# Altium schematic sheet ADC_Configuration.SchDoc: ADC Configuration
size Tabloid; Date: 06/01/2023; Engineer: Terry D. Schevker; Revision: 1.0; SheetNumber: 4; SheetTotal: 7
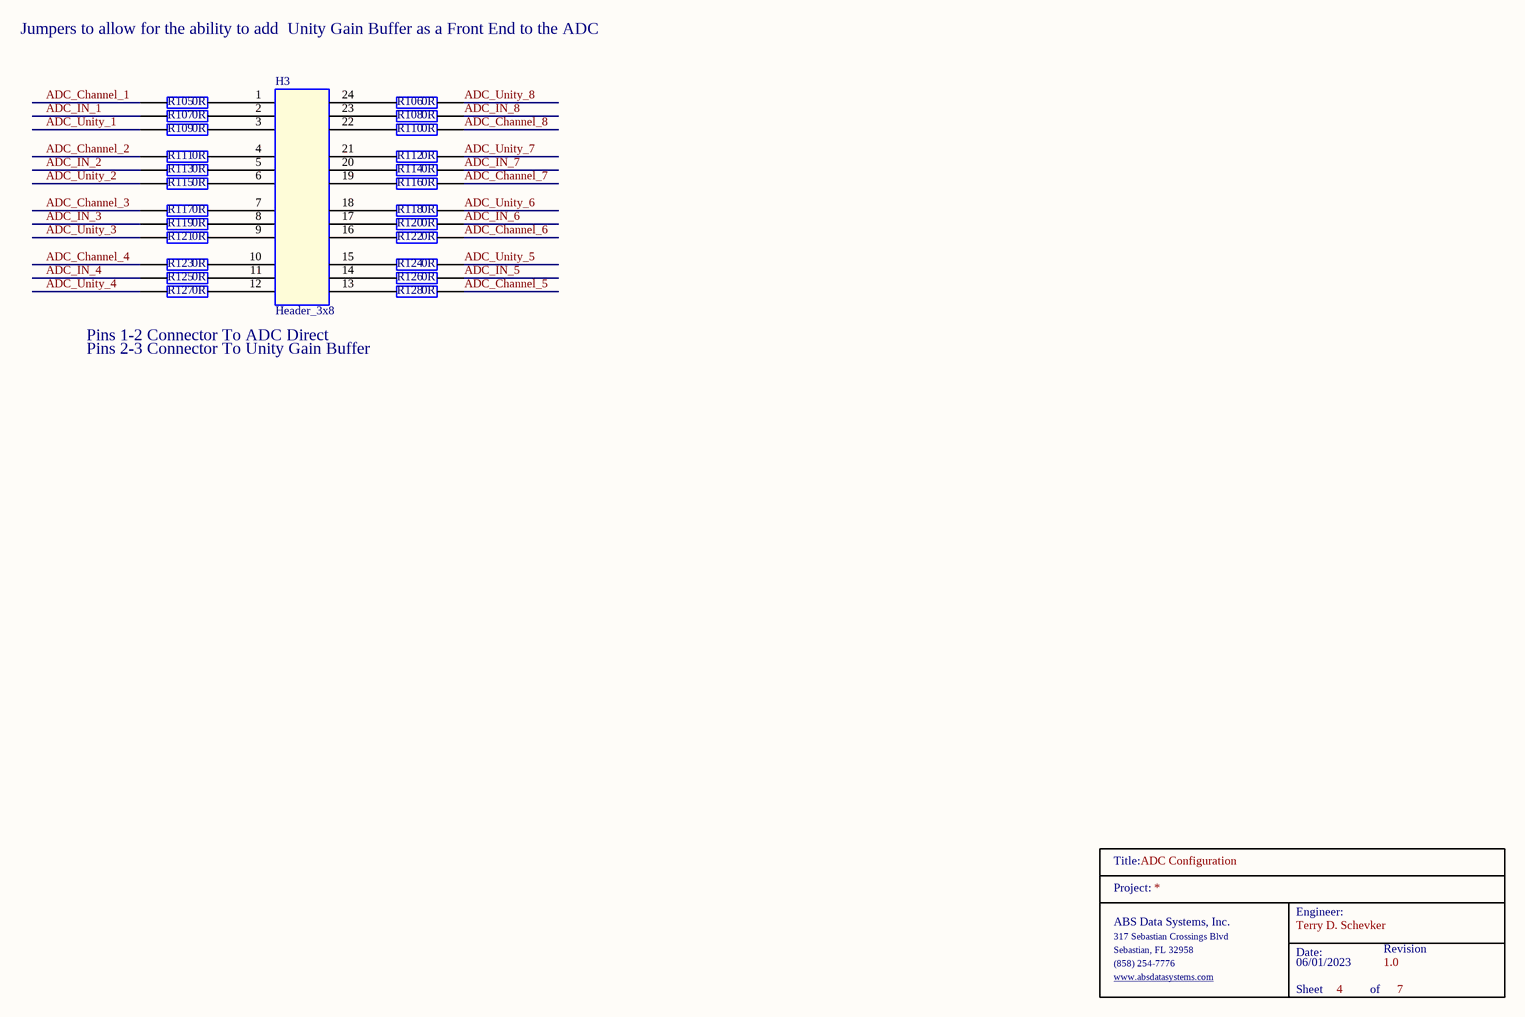
[diagram p0: ADC_Configuration.SchDoc]

## Parts
H3  Header_3x8  [HDR3X8]
R105  0R  [0603]
R106  0R  [0603]
R107  0R  [0603]
R108  0R  [0603]
R109  0R  [0603]
R110  0R  [0603]
R111  0R  [0603]
R112  0R  [0603]
R113  0R  [0603]
R114  0R  [0603]
R115  0R  [0603]
R116  0R  [0603]
R117  0R  [0603]
R118  0R  [0603]
R119  0R  [0603]
R120  0R  [0603]
R121  0R  [0603]
R122  0R  [0603]
R123  0R  [0603]
R124  0R  [0603]
R125  0R  [0603]
R126  0R  [0603]
R127  0R  [0603]
R128  0R  [0603]
TitleBlock_4  TitleBlock  (value not drawn)  (graphical)

## Nets
ADC_Channel_1: R105.1
ADC_Channel_2: R111.1
ADC_Channel_3: R117.1
ADC_Channel_4: R123.1
ADC_Channel_5: R128.2
ADC_Channel_6: R122.2
ADC_Channel_7: R116.2
ADC_Channel_8: R110.2
ADC_IN_1: R107.1
ADC_IN_2: R113.1
ADC_IN_3: R119.1
ADC_IN_4: R125.1
ADC_IN_5: R126.2
ADC_IN_6: R120.2
ADC_IN_7: R114.2
ADC_IN_8: R108.2
ADC_Unity_1: R109.1
ADC_Unity_2: R115.1
ADC_Unity_3: R121.1
ADC_Unity_4: R127.1
ADC_Unity_5: R124.2
ADC_Unity_6: R118.2
ADC_Unity_7: R112.2
ADC_Unity_8: R106.2
NetH3_1: H3.1 R105.2
NetH3_2: H3.2 R107.2
NetH3_3: H3.3 R109.2
NetH3_4: H3.4 R111.2
NetH3_5: H3.5 R113.2
NetH3_6: H3.6 R115.2
NetH3_7: H3.7 R117.2
NetH3_8: H3.8 R119.2
NetH3_9: H3.9 R121.2
NetH3_10: H3.10 R123.2
NetH3_11: H3.11 R125.2
NetH3_12: H3.12 R127.2
NetH3_13: H3.13 R128.1
NetH3_14: H3.14 R126.1
NetH3_15: H3.15 R124.1
NetH3_16: H3.16 R122.1
NetH3_17: H3.17 R120.1
NetH3_18: H3.18 R118.1
NetH3_19: H3.19 R116.1
NetH3_20: H3.20 R114.1
NetH3_21: H3.21 R112.1
NetH3_22: H3.22 R110.1
NetH3_23: H3.23 R108.1
NetH3_24: H3.24 R106.1

## Notes on the sheet
- Jumpers to allow for the ability to add  Unity Gain Buffer as a Front End to the ADC
- Pins 1-2 Connector To ADC Direct
- Pins 2-3 Connector To Unity Gain Buffer
- (in symbol TitleBlock) Title:; Project:; Engineer:; ABS Data Systems, Inc.; 317 Sebastian Crossings Blvd; Sebastian, FL 32958; Date:; Revision; (858) 254-7776; www.absdatasystems.com; Sheet; of

## Library data of the parts
H3 = Header_3x8: 16 Pin 3x8 Through Hold Jumprts; Manufacturer: Samtec; Manufacturer Part Number: TST-108-01-G-D; Number of Contacts: 16; Gender: Male; Connector Type: Male Pin; Pitch: 2.54mm; Row Spacing: 0.1inch; Supplier 1: Digi-Key; RoHS: Yes; Category: Headers and Wire Housings; Stock 1: 227; Pricing 1: 1=2.85000, 10=2.73600, 100=2.28000, 500=1.93800, 1000=1.65300, 5000=1.48200 (USD); Mount: Through Hole; Contact Plating: Gold; Contact Material: Bronze; Housing Material: Polyester; Housing Color: Black; Color: Black; Min Operating Temperature: -55°C; Max Operating Temperature: 125°C; Number of Rows: 2; Termination: Solder; Packaging: Rail/Tube; Orientation: Straight; Number of Positions: 16; Length: 27.94mm; Depth: 9.27mm; Contact Mating Length: 0.25inch; REACH SVHC: No SVHC; ComponentLink1URL: https://datasheet.ciiva.com/739/tst-mkt-739845.pdf?src-supplier=Digi-Key; ComponentLink1Description: https://datasheet.ciiva.com/739/tst-mkt-739845.pdf?src-supplier=Digi-Key; ComponentLink2URL: https://datasheet.ciiva.com/10018/htst-10018510.pdf?src-supplier=Avnet; ComponentLink2Description: https://datasheet.ciiva.com/10018/htst-10018510.pdf?src-supplier=Avnet
R105-R128 = RC0603JR-070RL: YAGEO 0603 0 ohm; Manufacturer_Name: KEMET; Geometry.Height: 0.55mm; Mouser Part Number: 603-RC0603JR-070RL; Mouser Price/Stock: https://www.mouser.co.uk/ProductDetail/YAGEO/RC0603JR-070RL?qs=2cAdsCoAWRGWyPcuXgGiXQ%3D%3D; Manufacturer_Part_Number: RC0603JR-070RL; Datasheet Link: https://datasheet.datasheetarchive.com/originals/distributors/Datasheets_SAMA/902f9e387b938f871d31120f5fc1d65e.pdf